# Altium schematic sheet FMC_connector.SchDoc: Metlino
size 420 x 297 mm; CheckedBy: P.Kulik,T.Przywozki,W.Ruclo; Author: G.Kasprowicz; CompanyName: WUT ISE; DrawnBy: G.Kasprowicz; Organization: WUT ISE; Address1: PW ISE; Address2: Nowowiejska 15/19 00-665 Warsaw; Address3: gkasprow@gmail.com; DocumentNumber: 18; Revision: 2; SheetNumber: 18; SheetTotal: 29; ModifiedBy: -; CheckedDate: -; Title2: FMC connector; DivGrp: WUT ISE; Designer: G.Kasprowicz; ModifiedDate: -; ProjectName: Sensor Box
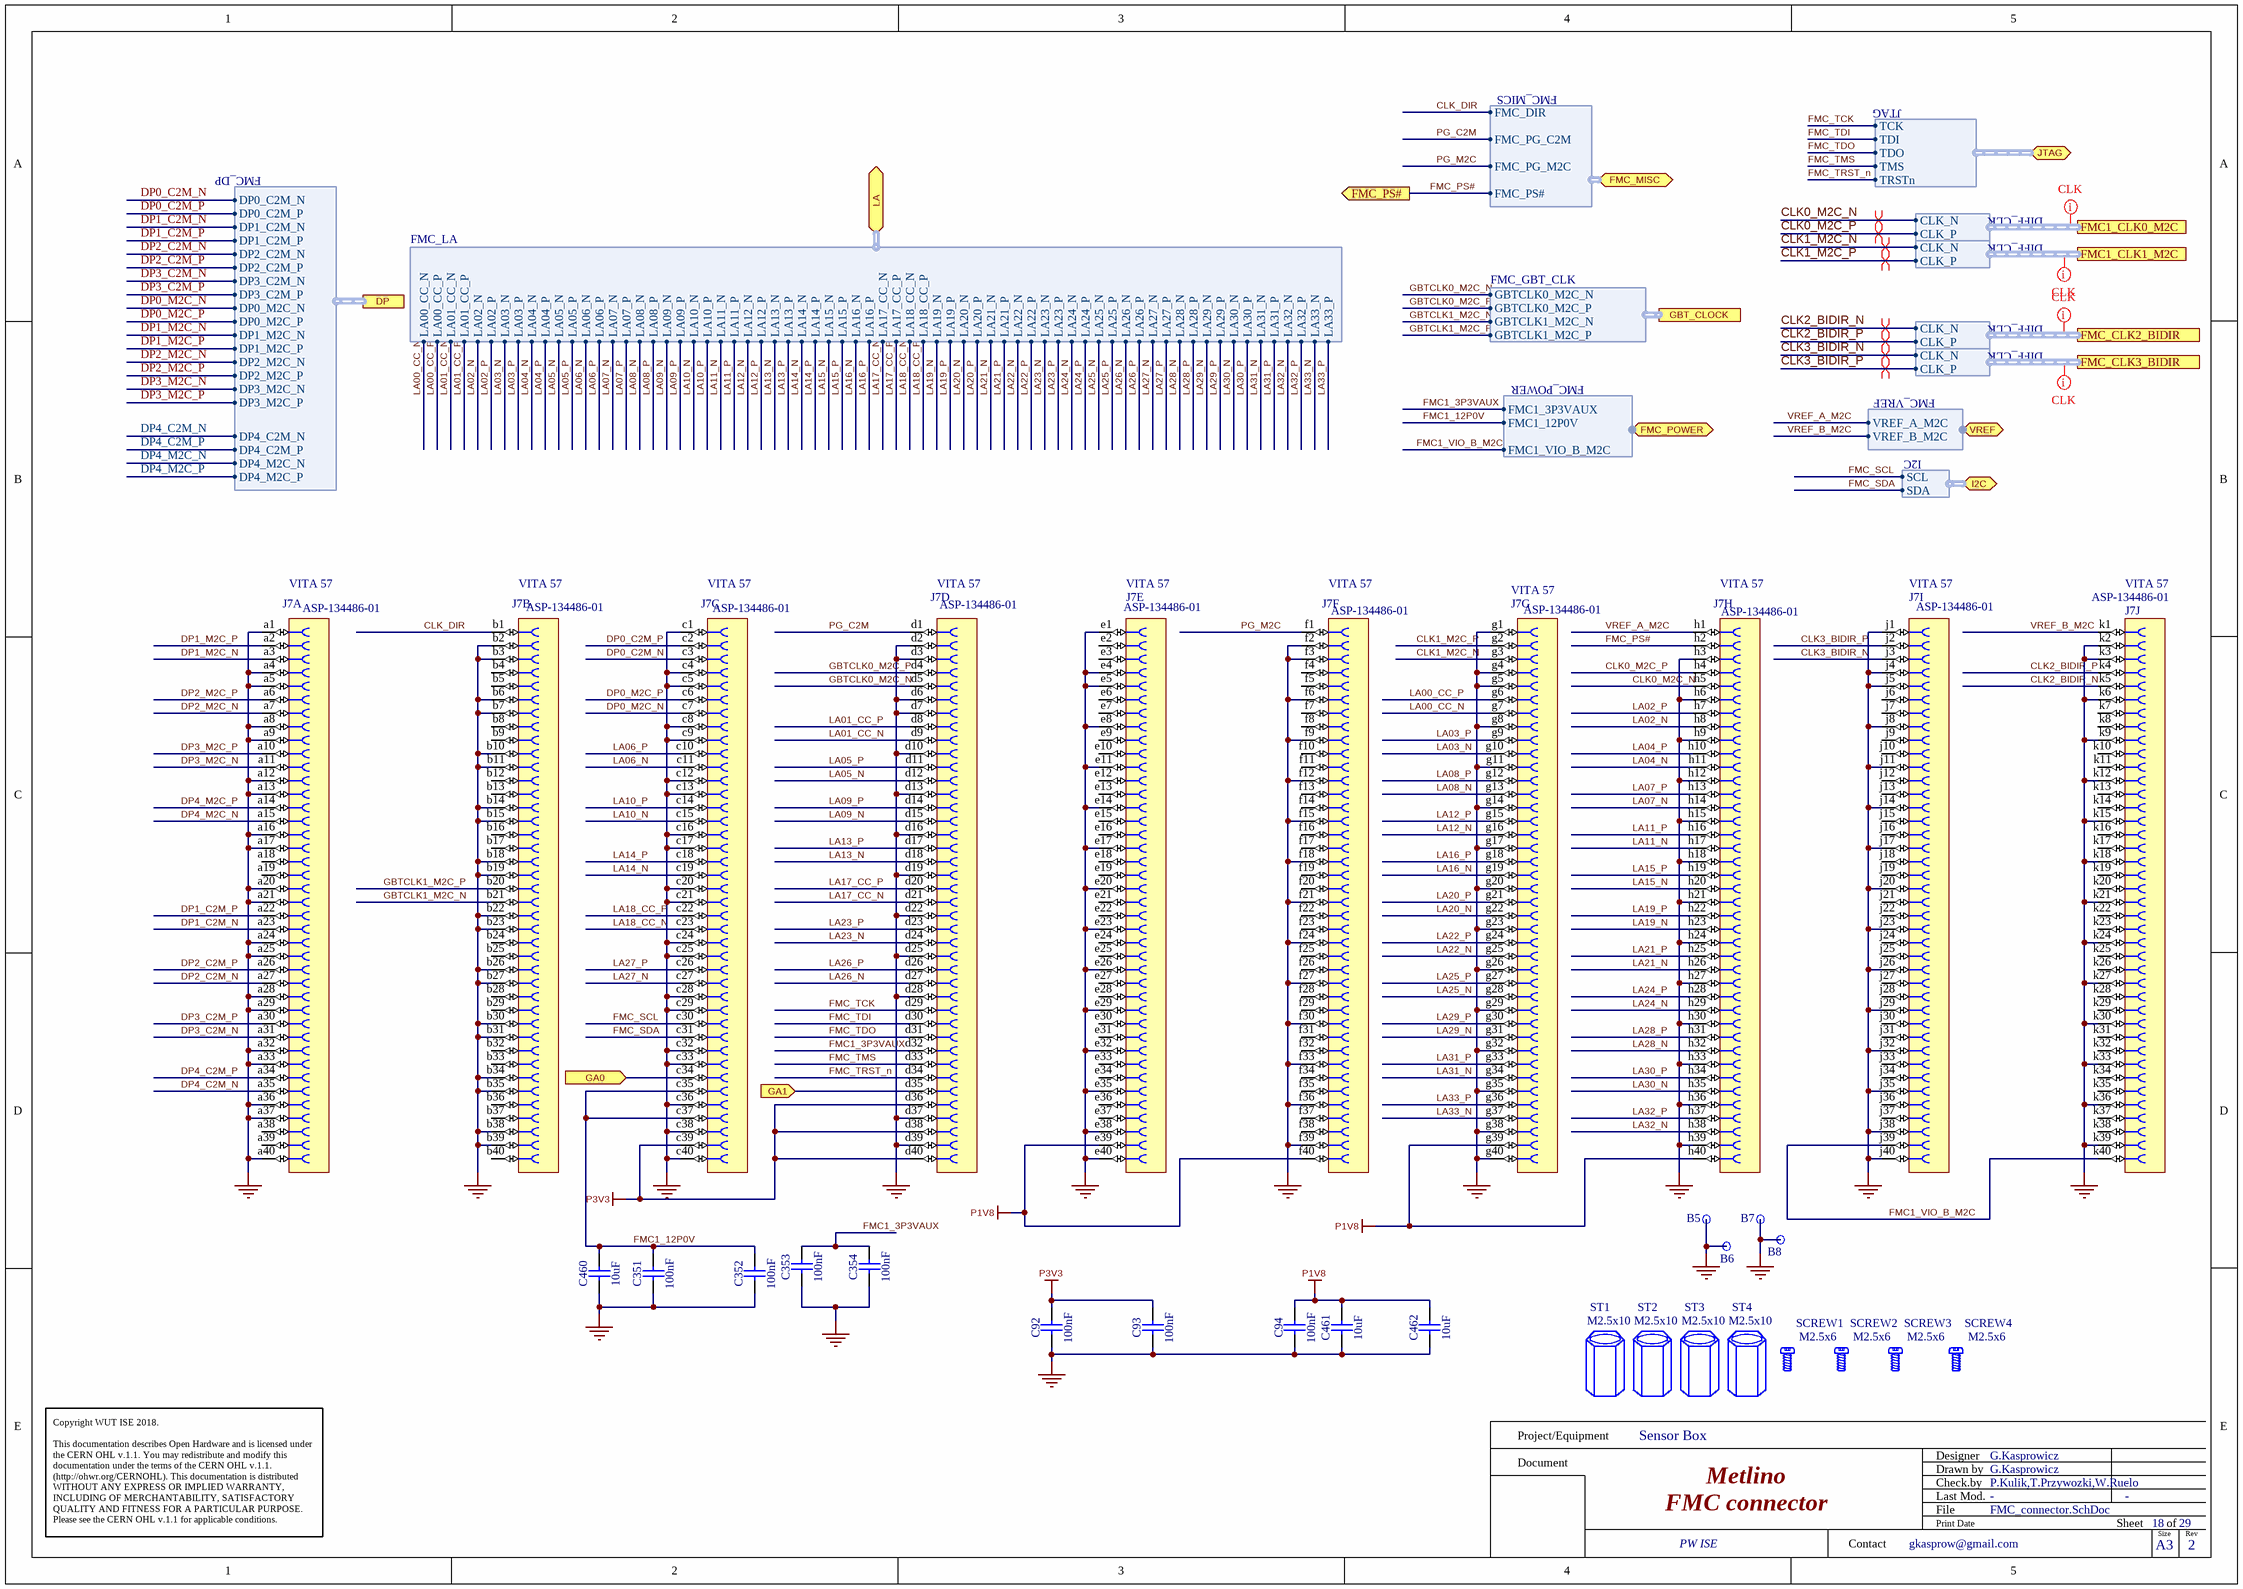
[diagram p0: FMC_connector.SchDoc]

## Parts
B5  PLATED_HOLE2.7_PAD5.0  [MTG270_500]  (value not drawn)
B6  PLATED_HOLE2.7_PAD5.0  [MTG270_500]  (value not drawn)
B7  PLATED_HOLE2.7_PAD5.0  [MTG270_500]  (value not drawn)
B8  PLATED_HOLE2.7_PAD5.0  [MTG270_500]  (value not drawn)
C92  100nF  [CAPC0603X33N]
C93  100nF  [CAPC0603X33N]
C94  100nF  [CAPC0603X33N]
C351  100nF  [CAPC1005X55N]
C352  100nF  [CAPC1005X55N]
C353  100nF  [CAPC1005X55N]
C354  100nF  [CAPC1005X55N]
C460  10uF  [CAPC3216X180N]
C461  10uF  [CAPC3216X180N]
C462  10uF  [CAPC3216X180N]
J7  VITA 57  Manufacturer Part Number: ASP-134486-01  [SAMTEC_ASP-134486-01]  (parts A,B,C,D,E,F,G,H,I,J of 10)
SCREW1  M2.5x6  [BOSSARD_BN5687-3061597_v]
SCREW2  M2.5x6  [BOSSARD_BN5687-3061597_v]
SCREW3  M2.5x6  [BOSSARD_BN5687-3061597_v]
SCREW4  M2.5x6  [BOSSARD_BN5687-3061597_v]
ST1  M2.5x10  [HARWIN_R25-1001002]
ST2  M2.5x10  [HARWIN_R25-1001002]
ST3  M2.5x10  [HARWIN_R25-1001002]
ST4  M2.5x10  [HARWIN_R25-1001002]

## Ports
DP (harness FMC_DP), FMC1_CLK0_M2C (harness DIFF_CLK), FMC1_CLK1_M2C (harness DIFF_CLK), FMC_CLK2_BIDIR (harness DIFF_CLK), FMC_CLK3_BIDIR (harness DIFF_CLK), FMC_MISC (bidir, harness FMC_MICS), FMC_POWER (bidir, harness FMC_POWER), FMC_PS# (out), GA0 (in), GA1 (in), GBT_CLOCK (harness FMC_GBT_CLK), I2C (bidir, harness I2C), JTAG (bidir, harness JTAG), LA (bidir, harness FMC_LA), VREF (bidir, harness FMC_VREF)

## Harnesses
FMC_LA: LA00_CC_N, LA00_CC_P, LA01_CC_N, LA01_CC_P, LA02_N, LA02_P, LA03_N, LA03_P, LA04_N, LA04_P, LA05_N, LA05_P, LA06_N, LA06_P, LA07_N, LA07_P, LA08_N, LA08_P, LA09_N, LA09_P, LA10_N, LA10_P, LA11_N, LA11_P, LA12_N, LA12_P, LA13_N, LA13_P, LA14_N, LA14_P, LA15_N, LA15_P, LA16_N, LA16_P, LA17_CC_N, LA17_CC_P, LA18_CC_N, LA18_CC_P, LA19_N, LA19_P, LA20_N, LA20_P, LA21_N, LA21_P, LA22_N, LA22_P, LA23_N, LA23_P, LA24_N, LA25_N, LA25_P, LA24_P, LA26_N, LA26_P, LA27_N, LA27_P, LA28_N, LA28_P, LA29_N, LA29_P, LA30_N, LA30_P, LA31_N, LA31_P, LA32_N, LA32_P, LA33_N, LA33_P
FMC_POWER: FMC1_3P3VAUX, FMC1_12P0V, FMC1_VIO_B_M2C
JTAG: TCK, TDI, TDO, TMS, TRSTn
FMC_MICS: FMC_PS#, FMC_PG_M2C, FMC_PG_C2M, FMC_DIR
FMC_DP: DP0_C2M_N, DP0_C2M_P, DP1_C2M_N, DP1_C2M_P, DP2_C2M_N, DP2_C2M_P, DP3_C2M_N, DP3_C2M_P, DP0_M2C_N, DP0_M2C_P, DP1_M2C_N, DP1_M2C_P, DP2_M2C_N, DP2_M2C_P, DP3_M2C_N, DP3_M2C_P, DP4_M2C_N, DP4_M2C_P, DP4_C2M_N, DP4_C2M_P
FMC_VREF: VREF_A_M2C, VREF_B_M2C
I2C: SCL, SDA
DIFF_CLK: CLK_P, CLK_N
FMC_GBT_CLK: GBTCLK0_M2C_N, GBTCLK0_M2C_P, GBTCLK1_M2C_N, GBTCLK1_M2C_P

## Nets
GND: B5.1 B6.1 B7.1 B8.1 C92.2 C93.2 C94.2 C351.1 C352.1 C353.1 C354.1 C460.1 C461.1 C462.1 J7.a1 J7.a4 J7.a5 J7.a8 J7.a9 J7.a12 J7.a13 J7.a16 J7.a17 J7.a20 J7.a21 J7.a24 J7.a25 J7.a28 J7.a29 J7.a32 J7.a33 J7.a36 J7.a37 J7.a40 J7.b2 J7.b3 J7.b6 J7.b7 J7.b10 J7.b11 J7.b14 J7.b15 J7.b18 J7.b19 J7.b22 J7.b23 J7.b26 J7.b27 J7.b30 J7.b31 J7.b34 J7.b35 J7.b38 J7.b39 J7.c1 J7.c4 J7.c5 J7.c8 J7.c9 J7.c12 J7.c13 J7.c16 J7.c17 J7.c20 J7.c21 J7.c24 J7.c25 J7.c28 J7.c29 J7.c32 J7.c33 J7.c36 J7.c38 J7.c40 J7.d2 J7.d3 J7.d6 J7.d7 J7.d10 J7.d13 J7.d16 J7.d19 J7.d22 J7.d25 J7.d28 J7.d37 J7.d39 J7.e1 J7.e4 J7.e5 J7.e8 J7.e11 J7.e14 J7.e17 J7.e20 J7.e23 J7.e26 J7.e29 J7.e32 J7.e35 J7.e38 J7.e40 J7.f2 J7.f3 J7.f6 J7.f9 J7.f12 J7.f15 J7.f18 J7.f21 J7.f24 J7.f27 J7.f30 J7.f33 J7.f36 J7.f39 J7.g1 J7.g4 J7.g5 J7.g8 J7.g11 J7.g14 J7.g17 J7.g20 J7.g23 J7.g26 J7.g29 J7.g32 J7.g35 J7.g38 J7.g40 J7.h3 J7.h6 J7.h9 J7.h12 J7.h15 J7.h18 J7.h21 J7.h24 J7.h27 J7.h30 J7.h33 J7.h36 J7.h39 J7.j1 J7.j4 J7.j5 J7.j8 J7.j11 J7.j14 J7.j17 J7.j20 J7.j23 J7.j26 J7.j29 J7.j32 J7.j35 J7.j38 J7.j40 J7.k2 J7.k3 J7.k6 J7.k9 J7.k12 J7.k15 J7.k18 J7.k21 J7.k24 J7.k27 J7.k30 J7.k33 J7.k36 J7.k39
P1V8: C94.1 C461.2 C462.2 J7.e39 J7.f40 J7.g39 J7.h40
P3V3: C92.1 C93.1 J7.c39 J7.d36 J7.d38 J7.d40
CLK0_M2C_N: J7.h5 ; port FMC1_CLK0_M2C.CLK_N
CLK0_M2C_P: J7.h4 ; port FMC1_CLK0_M2C.CLK_P
CLK1_M2C_N: J7.g3 ; port FMC1_CLK1_M2C.CLK_N
CLK1_M2C_P: J7.g2 ; port FMC1_CLK1_M2C.CLK_P
CLK2_BIDIR_N: J7.k5 ; port FMC_CLK2_BIDIR.CLK_N
CLK2_BIDIR_P: J7.k4 ; port FMC_CLK2_BIDIR.CLK_P
CLK3_BIDIR_N: J7.j3 ; port FMC_CLK3_BIDIR.CLK_N
CLK3_BIDIR_P: J7.j2 ; port FMC_CLK3_BIDIR.CLK_P
CLK_DIR: J7.b1 ; port FMC_MISC.FMC_DIR
DP0_C2M_N: J7.c3 ; port DP.DP0_C2M_N
DP0_C2M_P: J7.c2 ; port DP.DP0_C2M_P
DP0_M2C_N: J7.c7 ; port DP.DP0_M2C_N
DP0_M2C_P: J7.c6 ; port DP.DP0_M2C_P
DP1_C2M_N: J7.a23 ; port DP.DP1_C2M_N
DP1_C2M_P: J7.a22 ; port DP.DP1_C2M_P
DP1_M2C_N: J7.a3 ; port DP.DP1_M2C_N
DP1_M2C_P: J7.a2 ; port DP.DP1_M2C_P
DP2_C2M_N: J7.a27 ; port DP.DP2_C2M_N
DP2_C2M_P: J7.a26 ; port DP.DP2_C2M_P
DP2_M2C_N: J7.a7 ; port DP.DP2_M2C_N
DP2_M2C_P: J7.a6 ; port DP.DP2_M2C_P
DP3_C2M_N: J7.a31 ; port DP.DP3_C2M_N
DP3_C2M_P: J7.a30 ; port DP.DP3_C2M_P
DP3_M2C_N: J7.a11 ; port DP.DP3_M2C_N
DP3_M2C_P: J7.a10 ; port DP.DP3_M2C_P
DP4_C2M_N: J7.a35 ; port DP.DP4_C2M_N
DP4_C2M_P: J7.a34 ; port DP.DP4_C2M_P
DP4_M2C_N: J7.a15 ; port DP.DP4_M2C_N
DP4_M2C_P: J7.a14 ; port DP.DP4_M2C_P
FMC1_3P3VAUX: C353.2 C354.2 J7.d32 ; port FMC_POWER.FMC1_3P3VAUX
FMC1_12P0V: C351.2 C352.2 C460.2 J7.c35 J7.c37 ; port FMC_POWER.FMC1_12P0V
FMC1_VIO_B_M2C: J7.j39 J7.k40 ; port FMC_POWER.FMC1_VIO_B_M2C
FMC_PS#: J7.h2 ; port FMC_PS#, port FMC_MISC.FMC_PS#
FMC_SCL: J7.c30 ; port I2C.SCL
FMC_SDA: J7.c31 ; port I2C.SDA
FMC_TCK: J7.d29 ; port JTAG.TCK
FMC_TDI: J7.d30 ; port JTAG.TDI
FMC_TDO: J7.d31 ; port JTAG.TDO
FMC_TMS: J7.d33 ; port JTAG.TMS
FMC_TRST_n: J7.d34 ; port JTAG.TRSTn
GA0: J7.c34 ; port GA0
GA1: J7.d35 ; port GA1
GBTCLK0_M2C_N: J7.d5 ; port GBT_CLOCK.GBTCLK0_M2C_N
GBTCLK0_M2C_P: J7.d4 ; port GBT_CLOCK.GBTCLK0_M2C_P
GBTCLK1_M2C_N: J7.b21 ; port GBT_CLOCK.GBTCLK1_M2C_N
GBTCLK1_M2C_P: J7.b20 ; port GBT_CLOCK.GBTCLK1_M2C_P
LA00_CC_N: J7.g7 ; port LA.LA00_CC_N
LA00_CC_P: J7.g6 ; port LA.LA00_CC_P
LA01_CC_N: J7.d9 ; port LA.LA01_CC_N
LA01_CC_P: J7.d8 ; port LA.LA01_CC_P
LA02_N: J7.h8 ; port LA.LA02_N
LA02_P: J7.h7 ; port LA.LA02_P
LA03_N: J7.g10 ; port LA.LA03_N
LA03_P: J7.g9 ; port LA.LA03_P
LA04_N: J7.h11 ; port LA.LA04_N
LA04_P: J7.h10 ; port LA.LA04_P
LA05_N: J7.d12 ; port LA.LA05_N
LA05_P: J7.d11 ; port LA.LA05_P
LA06_N: J7.c11 ; port LA.LA06_N
LA06_P: J7.c10 ; port LA.LA06_P
LA07_N: J7.h14 ; port LA.LA07_N
LA07_P: J7.h13 ; port LA.LA07_P
LA08_N: J7.g13 ; port LA.LA08_N
LA08_P: J7.g12 ; port LA.LA08_P
LA09_N: J7.d15 ; port LA.LA09_N
LA09_P: J7.d14 ; port LA.LA09_P
LA10_N: J7.c15 ; port LA.LA10_N
LA10_P: J7.c14 ; port LA.LA10_P
LA11_N: J7.h17 ; port LA.LA11_N
LA11_P: J7.h16 ; port LA.LA11_P
LA12_N: J7.g16 ; port LA.LA12_N
LA12_P: J7.g15 ; port LA.LA12_P
LA13_N: J7.d18 ; port LA.LA13_N
LA13_P: J7.d17 ; port LA.LA13_P
LA14_N: J7.c19 ; port LA.LA14_N
LA14_P: J7.c18 ; port LA.LA14_P
LA15_N: J7.h20 ; port LA.LA15_N
LA15_P: J7.h19 ; port LA.LA15_P
LA16_N: J7.g19 ; port LA.LA16_N
LA16_P: J7.g18 ; port LA.LA16_P
LA17_CC_N: J7.d21 ; port LA.LA17_CC_N
LA17_CC_P: J7.d20 ; port LA.LA17_CC_P
LA18_CC_N: J7.c23 ; port LA.LA18_CC_N
LA18_CC_P: J7.c22 ; port LA.LA18_CC_P
LA19_N: J7.h23 ; port LA.LA19_N
LA19_P: J7.h22 ; port LA.LA19_P
LA20_N: J7.g22 ; port LA.LA20_N
LA20_P: J7.g21 ; port LA.LA20_P
LA21_N: J7.h26 ; port LA.LA21_N
LA21_P: J7.h25 ; port LA.LA21_P
LA22_N: J7.g25 ; port LA.LA22_N
LA22_P: J7.g24 ; port LA.LA22_P
LA23_N: J7.d24 ; port LA.LA23_N
LA23_P: J7.d23 ; port LA.LA23_P
LA24_N: J7.h29 ; port LA.LA24_N
LA24_P: J7.h28 ; port LA.LA24_P
LA25_N: J7.g28 ; port LA.LA25_N
LA25_P: J7.g27 ; port LA.LA25_P
LA26_N: J7.d27 ; port LA.LA26_N
LA26_P: J7.d26 ; port LA.LA26_P
LA27_N: J7.c27 ; port LA.LA27_N
LA27_P: J7.c26 ; port LA.LA27_P
LA28_N: J7.h32 ; port LA.LA28_N
LA28_P: J7.h31 ; port LA.LA28_P
LA29_N: J7.g31 ; port LA.LA29_N
LA29_P: J7.g30 ; port LA.LA29_P
LA30_N: J7.h35 ; port LA.LA30_N
LA30_P: J7.h34 ; port LA.LA30_P
LA31_N: J7.g34 ; port LA.LA31_N
LA31_P: J7.g33 ; port LA.LA31_P
LA32_N: J7.h38 ; port LA.LA32_N
LA32_P: J7.h37 ; port LA.LA32_P
LA33_N: J7.g37 ; port LA.LA33_N
LA33_P: J7.g36 ; port LA.LA33_P
PG_C2M: J7.d1 ; port FMC_MISC.FMC_PG_C2M
PG_M2C: J7.f1 ; port FMC_MISC.FMC_PG_M2C
VREF_A_M2C: J7.h1 ; port VREF.VREF_A_M2C
VREF_B_M2C: J7.k1 ; port VREF.VREF_B_M2C

Not connected (* = marked no-connect by the designer): J7 a18 a19 a38 a39 b4 b5 b8 b9 b12 b13 b16 b17 b24 b25 b28 b29 b32 b33 b36 b37 b40 e2 e3 e6 e7 e9 e10 e12 e13 e15 e16 e18 e19 e21 e22 e24 e25 e27 e28 e30 e31 e33 e34 e36 e37 f4 f5 f7 f8 f10 f11 f13 f14 f16 f17 f19 f20 f22 f23 f25 f26 f28 f29 f31 f32 f34 f35 f37 f38 j6 j7 j9 j10 j12 j13 j15 j16 j18 j19 j21 j22 j24 j25 j27 j28 j30 j31 j33 j34 j36 j37 k7 k8 k10 k11 k13 k14 k16 k17 k19 k20 k22 k23 k25 k26 k28 k29 k31 k32 k34 k35 k37 k38

## Layout directives
differential pair: CLK0_M2C_N, CLK0_M2C_P, CLK1_M2C_N, CLK1_M2C_P, CLK2_BIDIR_N, CLK2_BIDIR_P, CLK3_BIDIR_N, CLK3_BIDIR_P
net class CLK: (no net found under the mark)

## Notes on the sheet
- Project/Equipment
- Document
- Designer
- Drawn by
- Check.by
- Copyright WUT ISE 2018.
  This documentation describes Open Hardware and is licensed under the CERN OHL v.1.1. You may redistribute and modify this documentation under the terms of the CERN OHL v.1.1. (http://ohwr.org/CERNOHL). This documentation is distributed WITHOUT ANY EXPRESS OR IMPLIED WARRANTY, INCLUDING OF MERCHANTABILITY, SATISFACTORY QUALITY AND FITNESS FOR A PARTICULAR PURPOSE. Please see the CERN OHL v.1.1 for applicable conditions.
- Contact
- File
- Last Mod.
- Print Date
- Sheet
- Size
- A3
- of
- Rev

## Library data of the parts
B5 = MTG270_500: Part Description: Plated Through Hole: Hole Dia.=2.7mm Pad Dia.=5.0mm; $$Internal_Resolution: 00001mm; $$NotCommonProperty_Family: Plated Hole; $$NotCommonProperty_Mounted: No; $$NotCommonProperty_Pin Count: 1; $$NotCommonProperty_Sense: No; $$NotCommonProperty_Status: None; CmpIndex: 27; DXDB_LIBNAME: Pads; Ref Designator: B1; SymIndex: 1608; $$NotCommonProperty_ComponentHeight: 0mm; $$NotCommonProperty_Footprint Ref: MTG270_500; $$NotCommonProperty_SMD: No; $$NotCommonProperty_Socket: No; Cell Name: MTG270_500; Part Name: PLATED_HOLE2.7_PAD5.0; Part Number: PLATED_HOLE2.7_PAD5.0; Orientation: 0 = 0
B6 = MTG270_500: Part Description: Plated Through Hole: Hole Dia.=2.7mm Pad Dia.=5.0mm; $$Internal_Resolution: 00001mm; $$NotCommonProperty_Family: Plated Hole; $$NotCommonProperty_Mounted: No; $$NotCommonProperty_Pin Count: 1; $$NotCommonProperty_Sense: No; $$NotCommonProperty_Status: None; CmpIndex: 10; DXDB_LIBNAME: Pads; Ref Designator: B2; SymIndex: 1608; $$NotCommonProperty_ComponentHeight: 0mm; $$NotCommonProperty_Footprint Ref: MTG270_500; $$NotCommonProperty_SMD: No; $$NotCommonProperty_Socket: No; Cell Name: MTG270_500; Part Name: PLATED_HOLE2.7_PAD5.0; Part Number: PLATED_HOLE2.7_PAD5.0; Orientation: 0 = 0
B7 = MTG270_500: Part Description: Plated Through Hole: Hole Dia.=2.7mm Pad Dia.=5.0mm; $$Internal_Resolution: 00001mm; $$NotCommonProperty_Family: Plated Hole; $$NotCommonProperty_Mounted: No; $$NotCommonProperty_Pin Count: 1; $$NotCommonProperty_Sense: No; $$NotCommonProperty_Status: None; CmpIndex: 11; DXDB_LIBNAME: Pads; Ref Designator: B3; SymIndex: 1608; $$NotCommonProperty_ComponentHeight: 0mm; $$NotCommonProperty_Footprint Ref: MTG270_500; $$NotCommonProperty_SMD: No; $$NotCommonProperty_Socket: No; Cell Name: MTG270_500; Part Name: PLATED_HOLE2.7_PAD5.0; Part Number: PLATED_HOLE2.7_PAD5.0; Orientation: 0 = 0
B8 = MTG270_500: Part Description: Plated Through Hole: Hole Dia.=2.7mm Pad Dia.=5.0mm; $$Internal_Resolution: 00001mm; $$NotCommonProperty_Family: Plated Hole; $$NotCommonProperty_Mounted: No; $$NotCommonProperty_Pin Count: 1; $$NotCommonProperty_Sense: No; $$NotCommonProperty_Status: None; CmpIndex: 12; DXDB_LIBNAME: Pads; Ref Designator: B4; SymIndex: 1608; $$NotCommonProperty_ComponentHeight: 0mm; $$NotCommonProperty_Footprint Ref: MTG270_500; $$NotCommonProperty_SMD: No; $$NotCommonProperty_Socket: No; Cell Name: MTG270_500; Part Name: PLATED_HOLE2.7_PAD5.0; Part Number: PLATED_HOLE2.7_PAD5.0; Orientation: 0 = 0
C92-C94 = CC0201_100NF_6.3V_10%_X5R: Non-polarised capacitor; Manufacturer: GENERIC; Part Description: SMD Multilayer Chip Ceramic Capacitor; Manufacturer1 Part Number: 02016D104KAT2A; Tolerance: ±10%; Voltage: 6.3V; TC: X5R; Manufacturer Part Number: CC0201_100NF_6.3V_10%_X5R; Part Number: CC0201_100NF_6.3V_10%_X5R; Value: 100nF; Component Kind: Standard; Component Type: Standard; Pin Count: 2; Status: Not Recommended; Case: 0201; Mounted: Yes; Socket: No; SMD: Yes; Sense: No; Manufacturer1 Example: AVX; Manufacturer1 ComponentHeight: 0.33mm; HelpURL: \\cern.ch\dfs\Applications\Altium\Datasheets\CC0201_X5R_AVX.pdf; Author: CERN DEM JLC; CreateDate: 03.12.2007; LatestRevisionDate: 03.12.2007
C351-C354 = CC0402_100NF_16V_10%_X5R: Non-polarised capacitor; Manufacturer: GENERIC; Part Description: SMD Multilayer Chip Ceramic Capacitor; Manufacturer1 Part Number: GRM155R61C104KA88D; Tolerance: ±10%; Voltage: 16V; TC: X5R; Manufacturer Part Number: CC0402_100NF_16V_10%_X5R; Part Number: CC0402_100NF_16V_10%_X5R; Value: 100nF; Component Kind: Standard; Component Type: Standard; Pin Count: 2; Status: None; Case: 0402; Mounted: Yes; Socket: No; SMD: Yes; Sense: No; Manufacturer1 Example: MURATA; Manufacturer1 ComponentHeight: 0.55mm; HelpURL: \\cern.ch\dfs\Applications\Altium\Datasheets\CC0402_X5R_MURATA_GRM.pdf; Author: CERN DEM JLC; CreateDate: 10.12.2013; LatestRevisionDate: 10.12.2013
C460-C462 = CC1206_10uF_25V_10%_X7R: Non-polarised capacitor; Manufacturer: GENERIC; Part Description: SMD Multilayer Chip Ceramic Capacitor; Manufacturer1 Part Number: C1206C106K4RACTU; Tolerance: ±10%; Voltage: 25V; TC: X7R; Manufacturer Part Number: CC1206_10uF_25V_10%_X7R; Part Number: CC1206_10UF_25V_10%_X7R; Value: 10uF; Component Kind: Standard; Component Type: Standard; Pin Count: 2; Status: Preferred; Case: 1206; Mounted: Yes; Socket: No; SMD: Yes; Sense: No; Manufacturer1 Example: KEMET; Manufacturer1 ComponentHeight: 1.8mm; HelpURL: \\cern.ch\dfs\Applications\Altium\Datasheets\CC1206_X7R_KEMET.pdf; Author: CERN DEM JLC; CreateDate: 12.09.2012; LatestRevisionDate: 12.09.2012
J7 = SAMTEC_ASP-134486-01: Connector VITA 57, 400 Female contacts in 10 row abcdefghj; Manufacturer: SAMTEC; Part Description: 400 contacts (10 rows abcdefghj) Surface Mount Female Connector, VITA 57 (CC-HPC-10); PressFit: No; Part Number: SAMTEC_ASP-134486-01; Component Kind: Standard; Component Type: Standard; Pin Count: 400; Family: VITA 57; Mounted: Yes; Socket: No; Sense: No; SMD: Yes; Status: None; ComponentHeight: 6.55mm; HelpURL: \\cern.ch\dfs\Applications\Altium\Datasheets\SAMTEC_ASP-134486-01.pdf; Author: CERN DEM JLC; CreateDate: 30.04.2009; LatestRevisionDate: 17.08.2009
SCREW1-SCREW4 = BOSSARD_BN5687-3061597_v: Screw; Part Description: M2.5 L=6mm Hexalobular Socket Pan Head Screw, Fully Threaded, Stainless Steel A2; Manufacturer Part Number: BN5687 Art.3061597; PressFit: No; Part Number: BOSSARD_BN5687-3061597_v; Component Kind: Standard; Component Type: Mechanical; Pin Count: 0; PackageDescription: M2.5 L=6mm Hexalobular Socket Pan Head Screw, Fully Threaded - Stainless Steel A2; Mounted: Yes; Socket: No; SMD: No; Sense: No; Status: None; Value: M2.5x6; Manufacturer: BOSSARD; ComponentHeight: 2.1mm; HelpURL: \\cern.ch\dfs\Applications\Altium\Datasheets\BOSSARD_BN5687-3061597.pdf; Author: CERN DEM JLC; CreateDate: 30.05.2013; LatestRevisionDate: 30.05.2013
ST1-ST4 = MECH_Standoff_M2.5x10: M2.5x10 standoff; Part Description: M2.5x10 female Hex Spacer made of free-machining brass with nickel plated finish; Manufacturer: HARWIN; Manufacturer Part Number: R25-1001002; PressFit: No; Part Number: HARWIN_R25-1001002; Component Kind: Standard; Component Type: Mechanical; Pin Count: 0; PackageDescription: M2.5 L=6mm Hexalobular Socket Pan Head Screw, Fully Threaded - Stainless Steel A2; Mounted: Yes; Socket: No; SMD: No; Sense: No; Status: None; Value: M2.5x10; ComponentHeight: 10mm; HelpURL: \\cern.ch\dfs\Applications\Altium\Datasheets\BOSSARD_BN5687-3061597.pdf; Author: GK; CreateDate: 25.02.2019; LatestRevisionDate: 25.02.2019